# EasyEDA Pro project ProDoc_917_control_board_B.epro, schematic 917 control board_B, sheets 1 to 3 of 8

## Sheets
1 relay: Board Name: 917 control board_B; Create Date: 2025-07-29; Page Name: relay; Project Name: OHPP-002A-SiWG917 control board; Schematic Name: 917 control board_B; Update Date: 2025-08-06; Company: EasyEDA.com; Page Size: A3; Version: V1.0
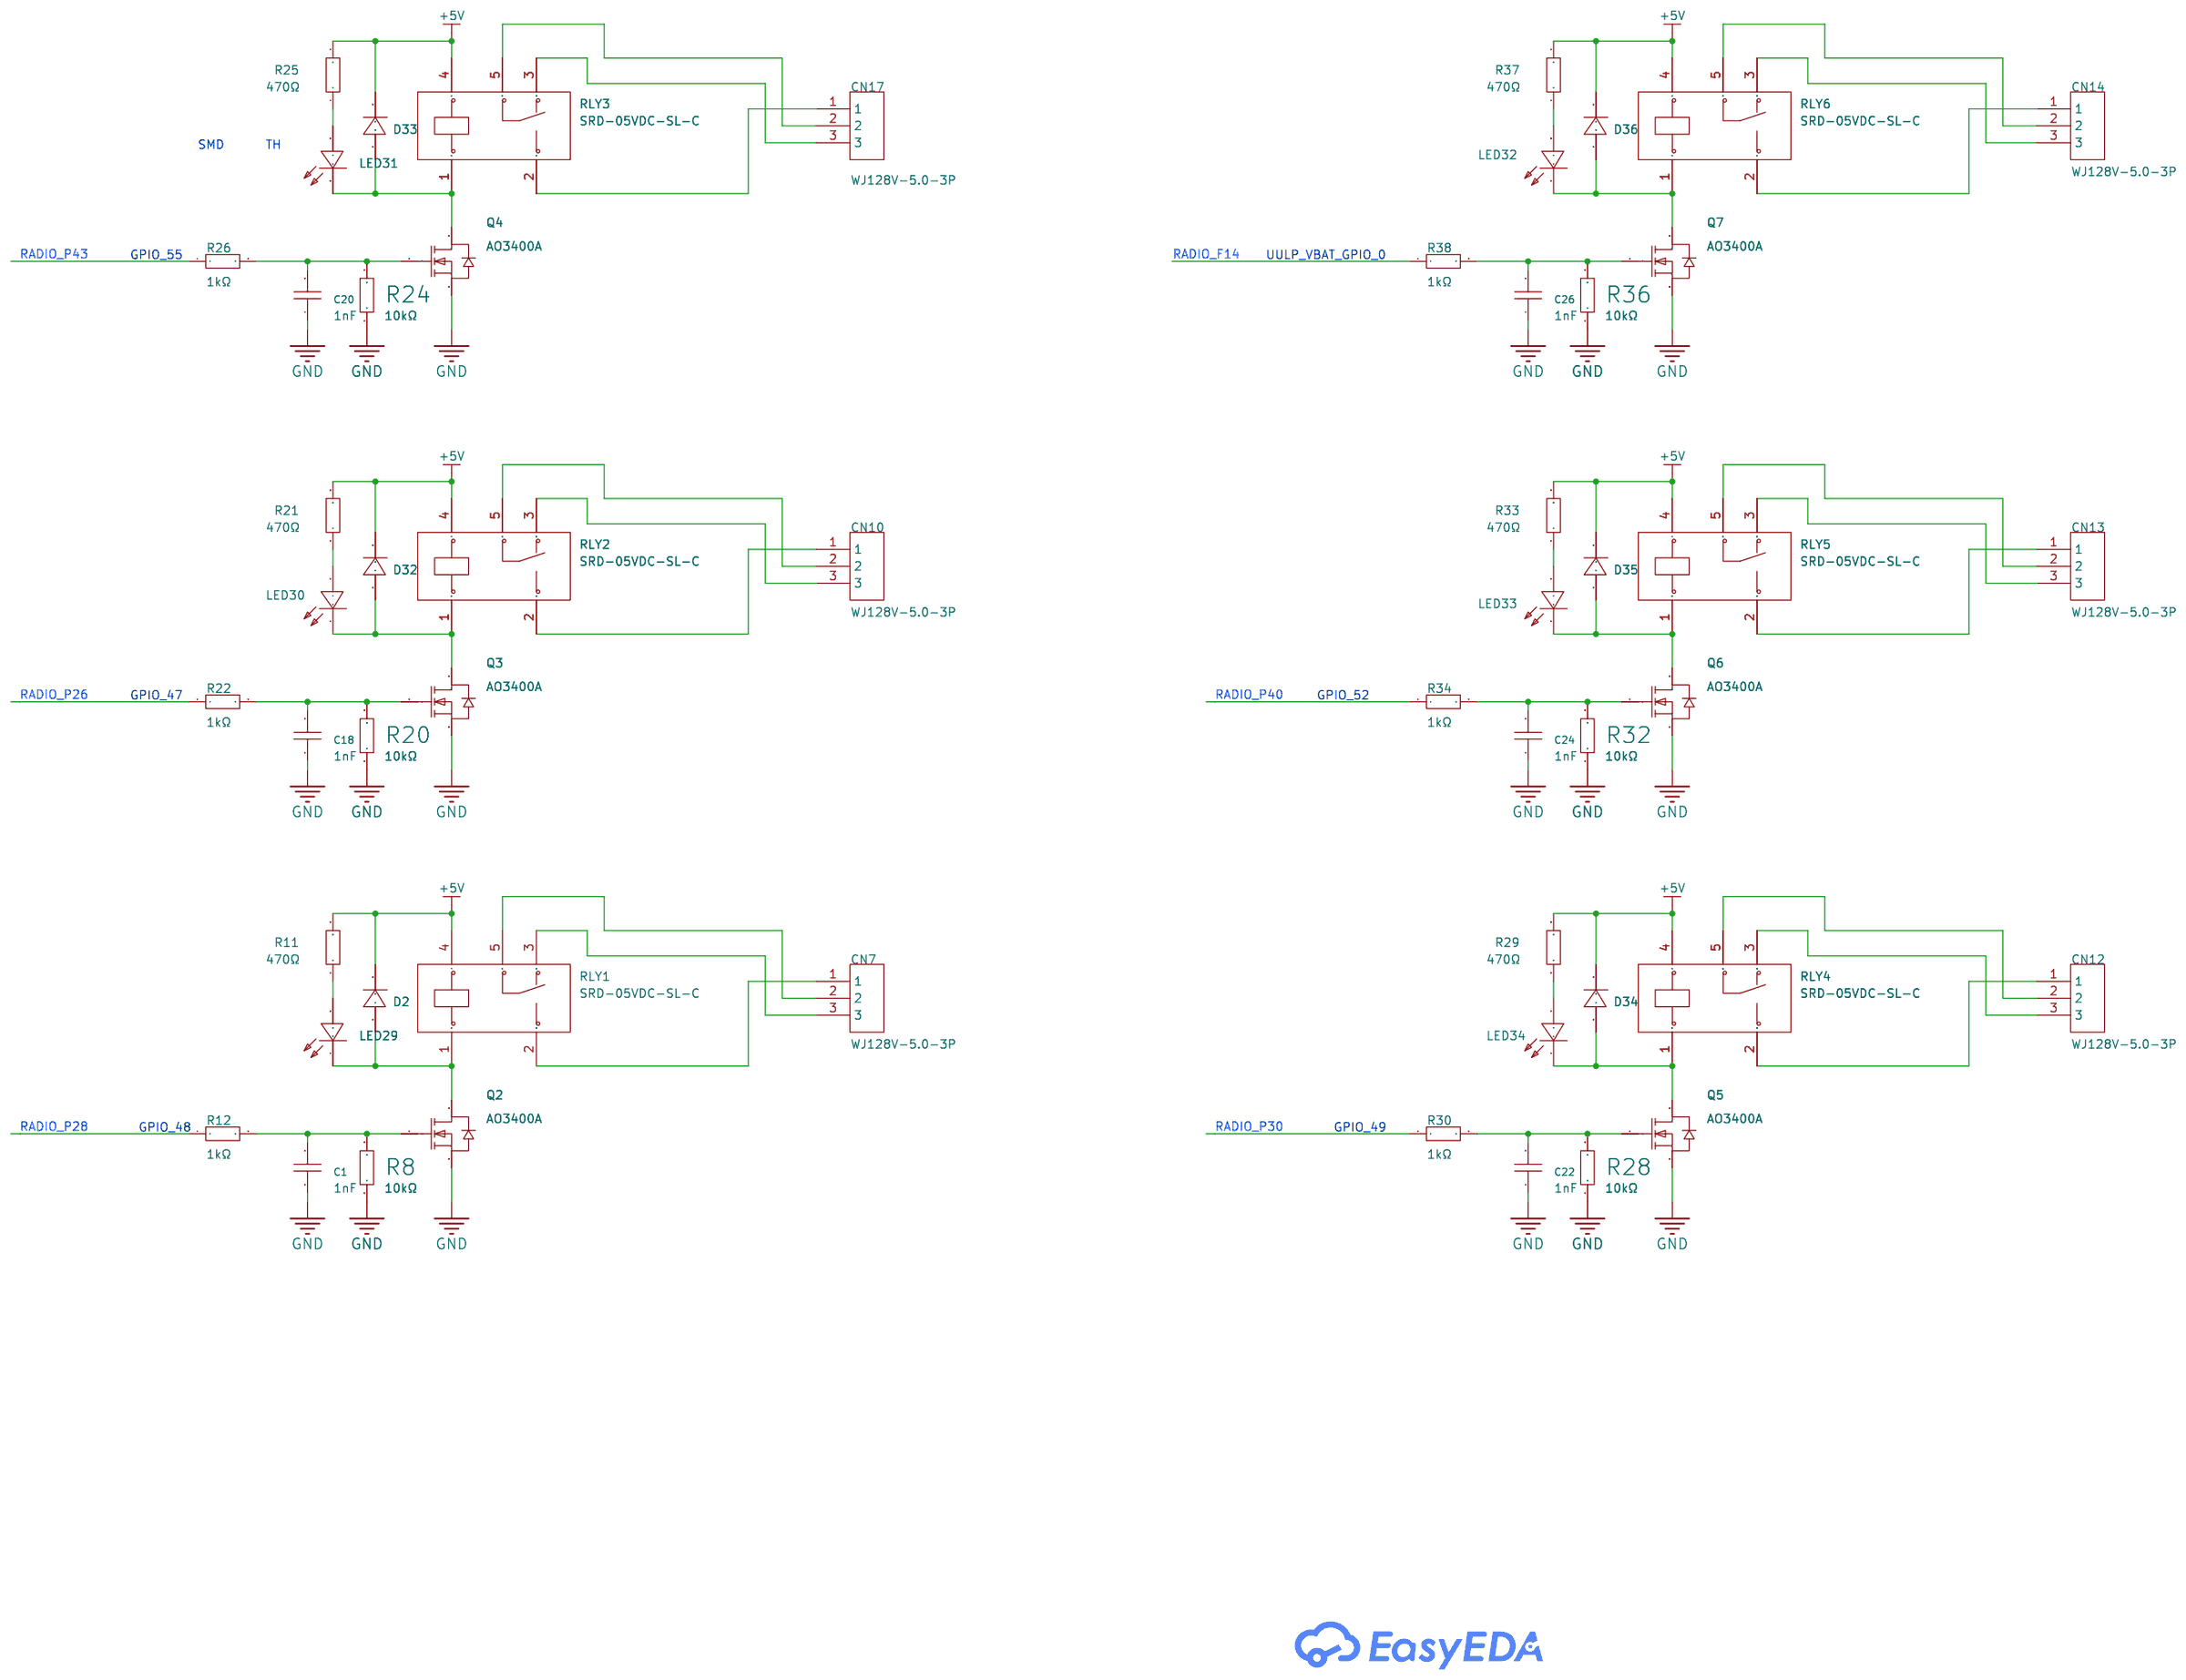
[diagram p0: relay]
2 917_radio_board: Page Name: 917_radio_board; Update Date: 2025-08-12
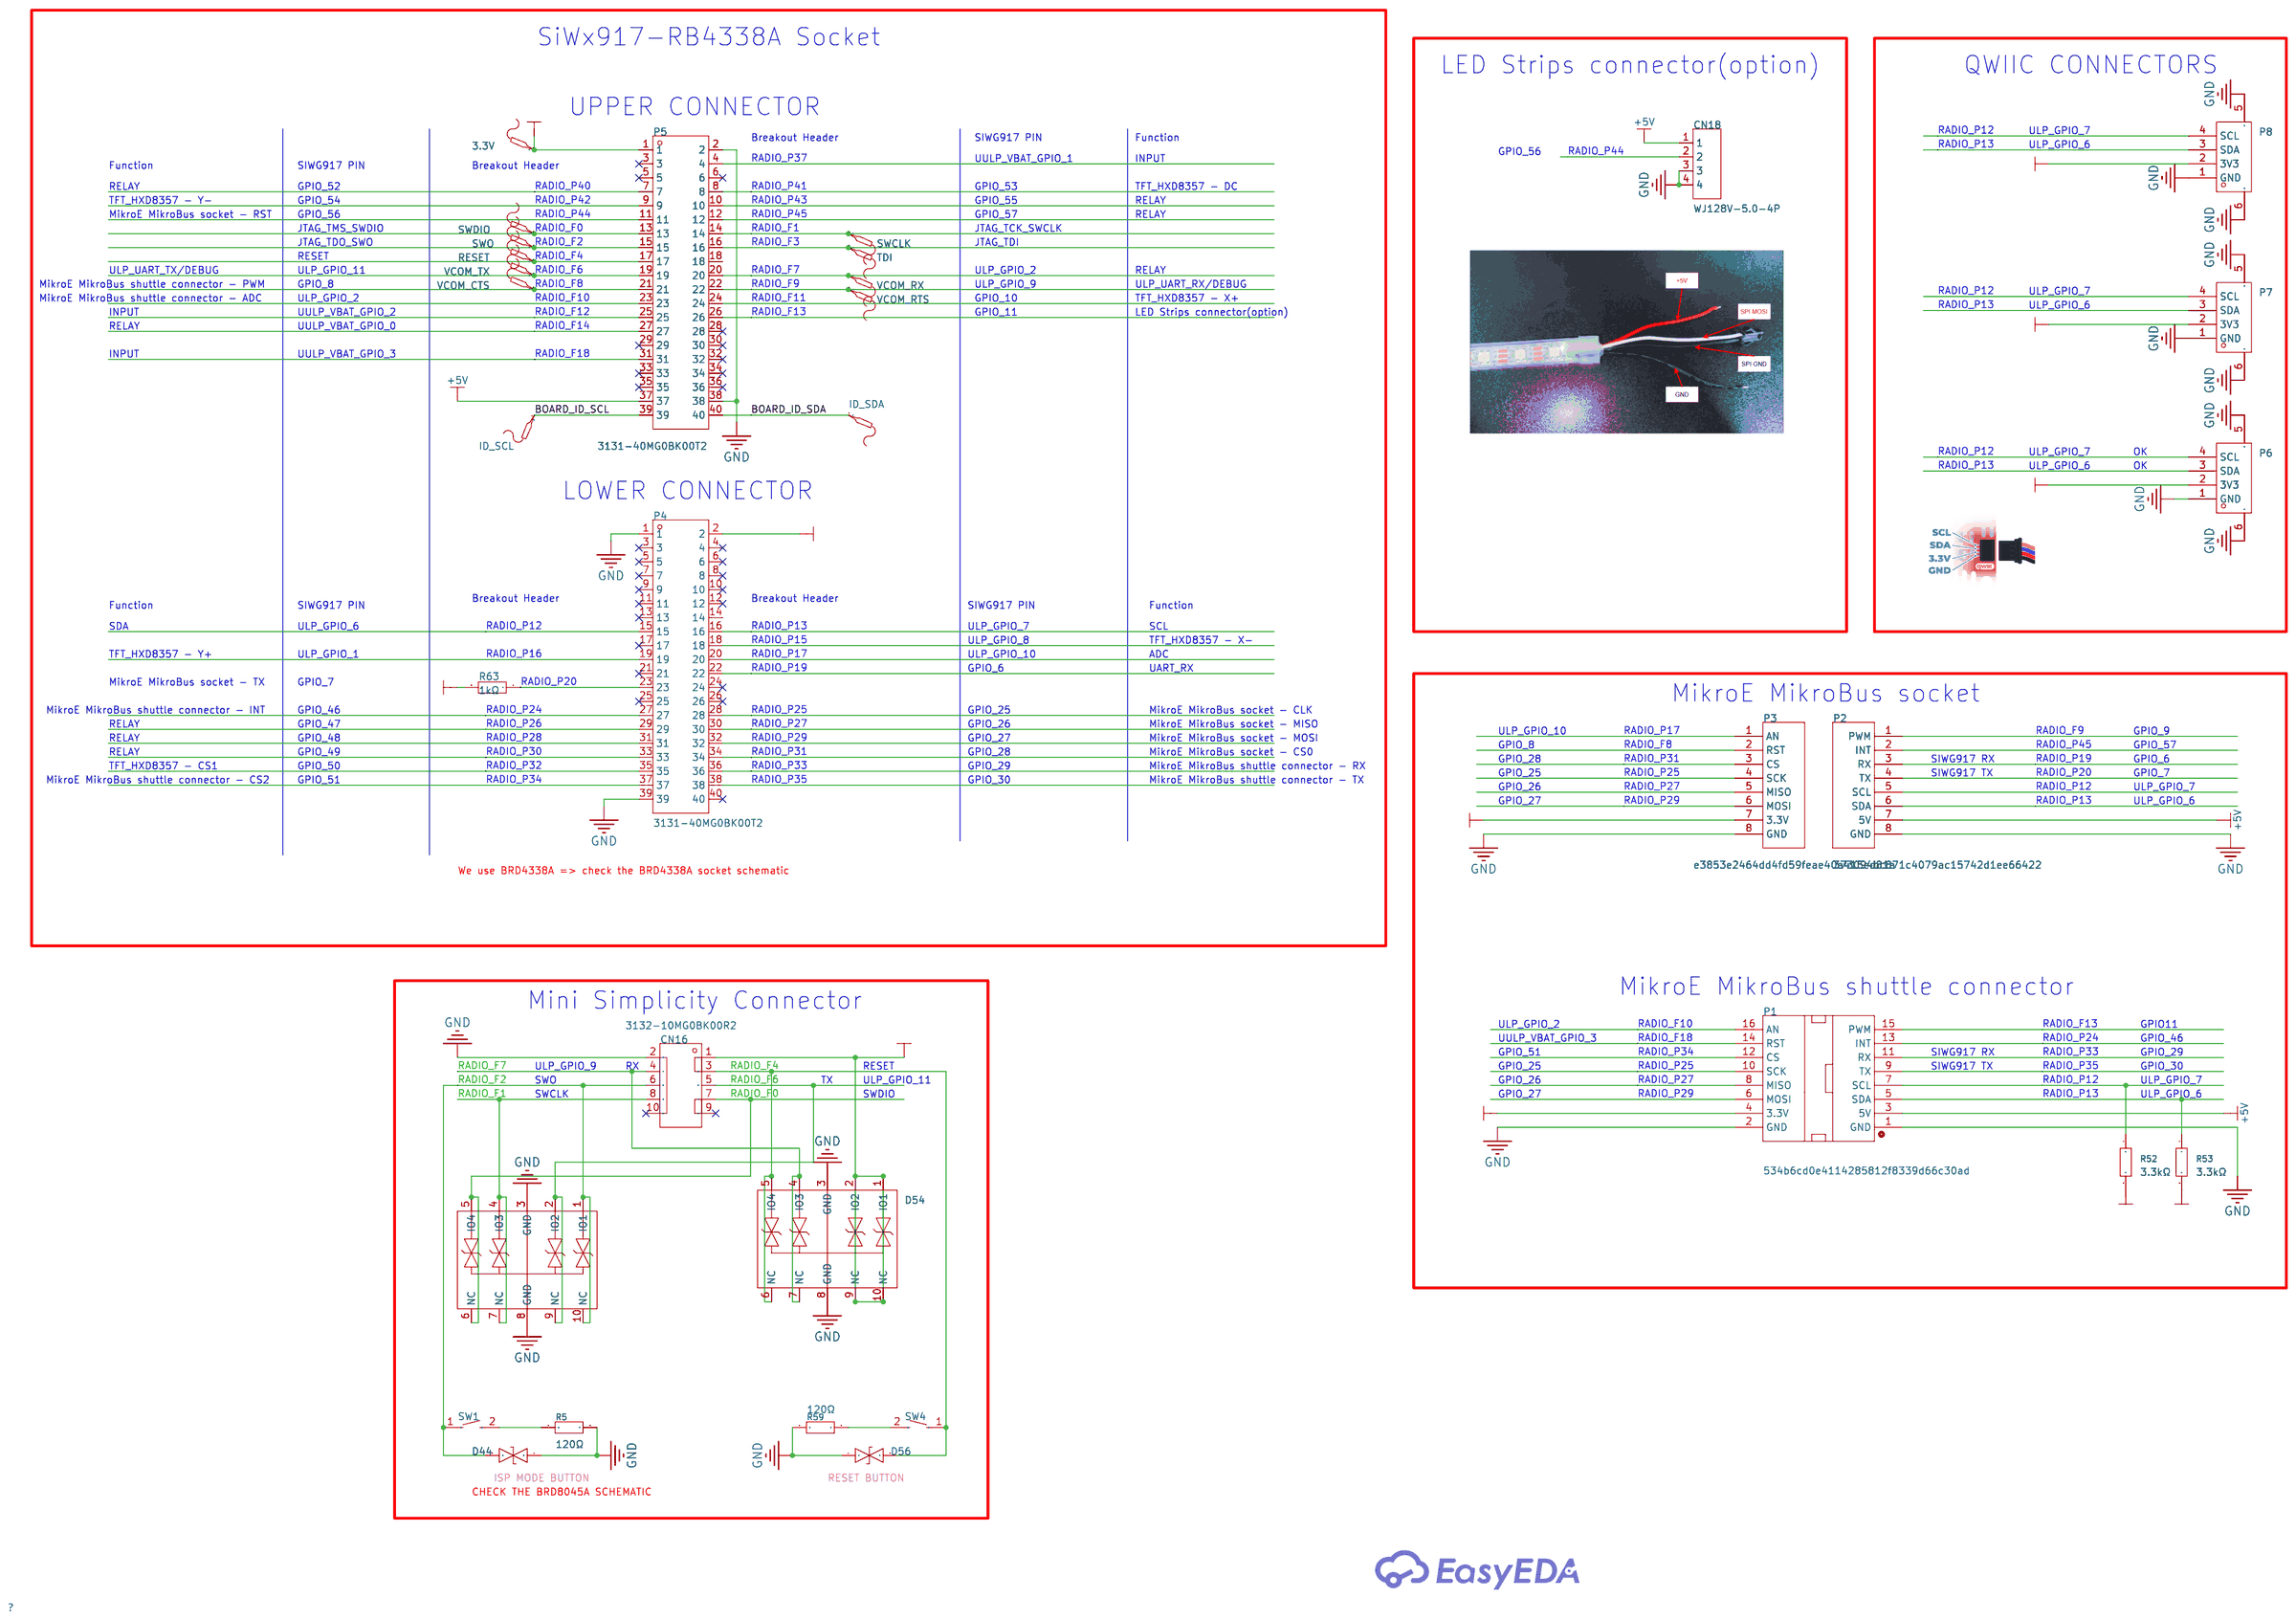
[diagram p1: 917_radio_board]
3 input: Page Name: P1; Project Name: Project Name; Schematic Name: Schematic Name; Update Date: 2021.11.05
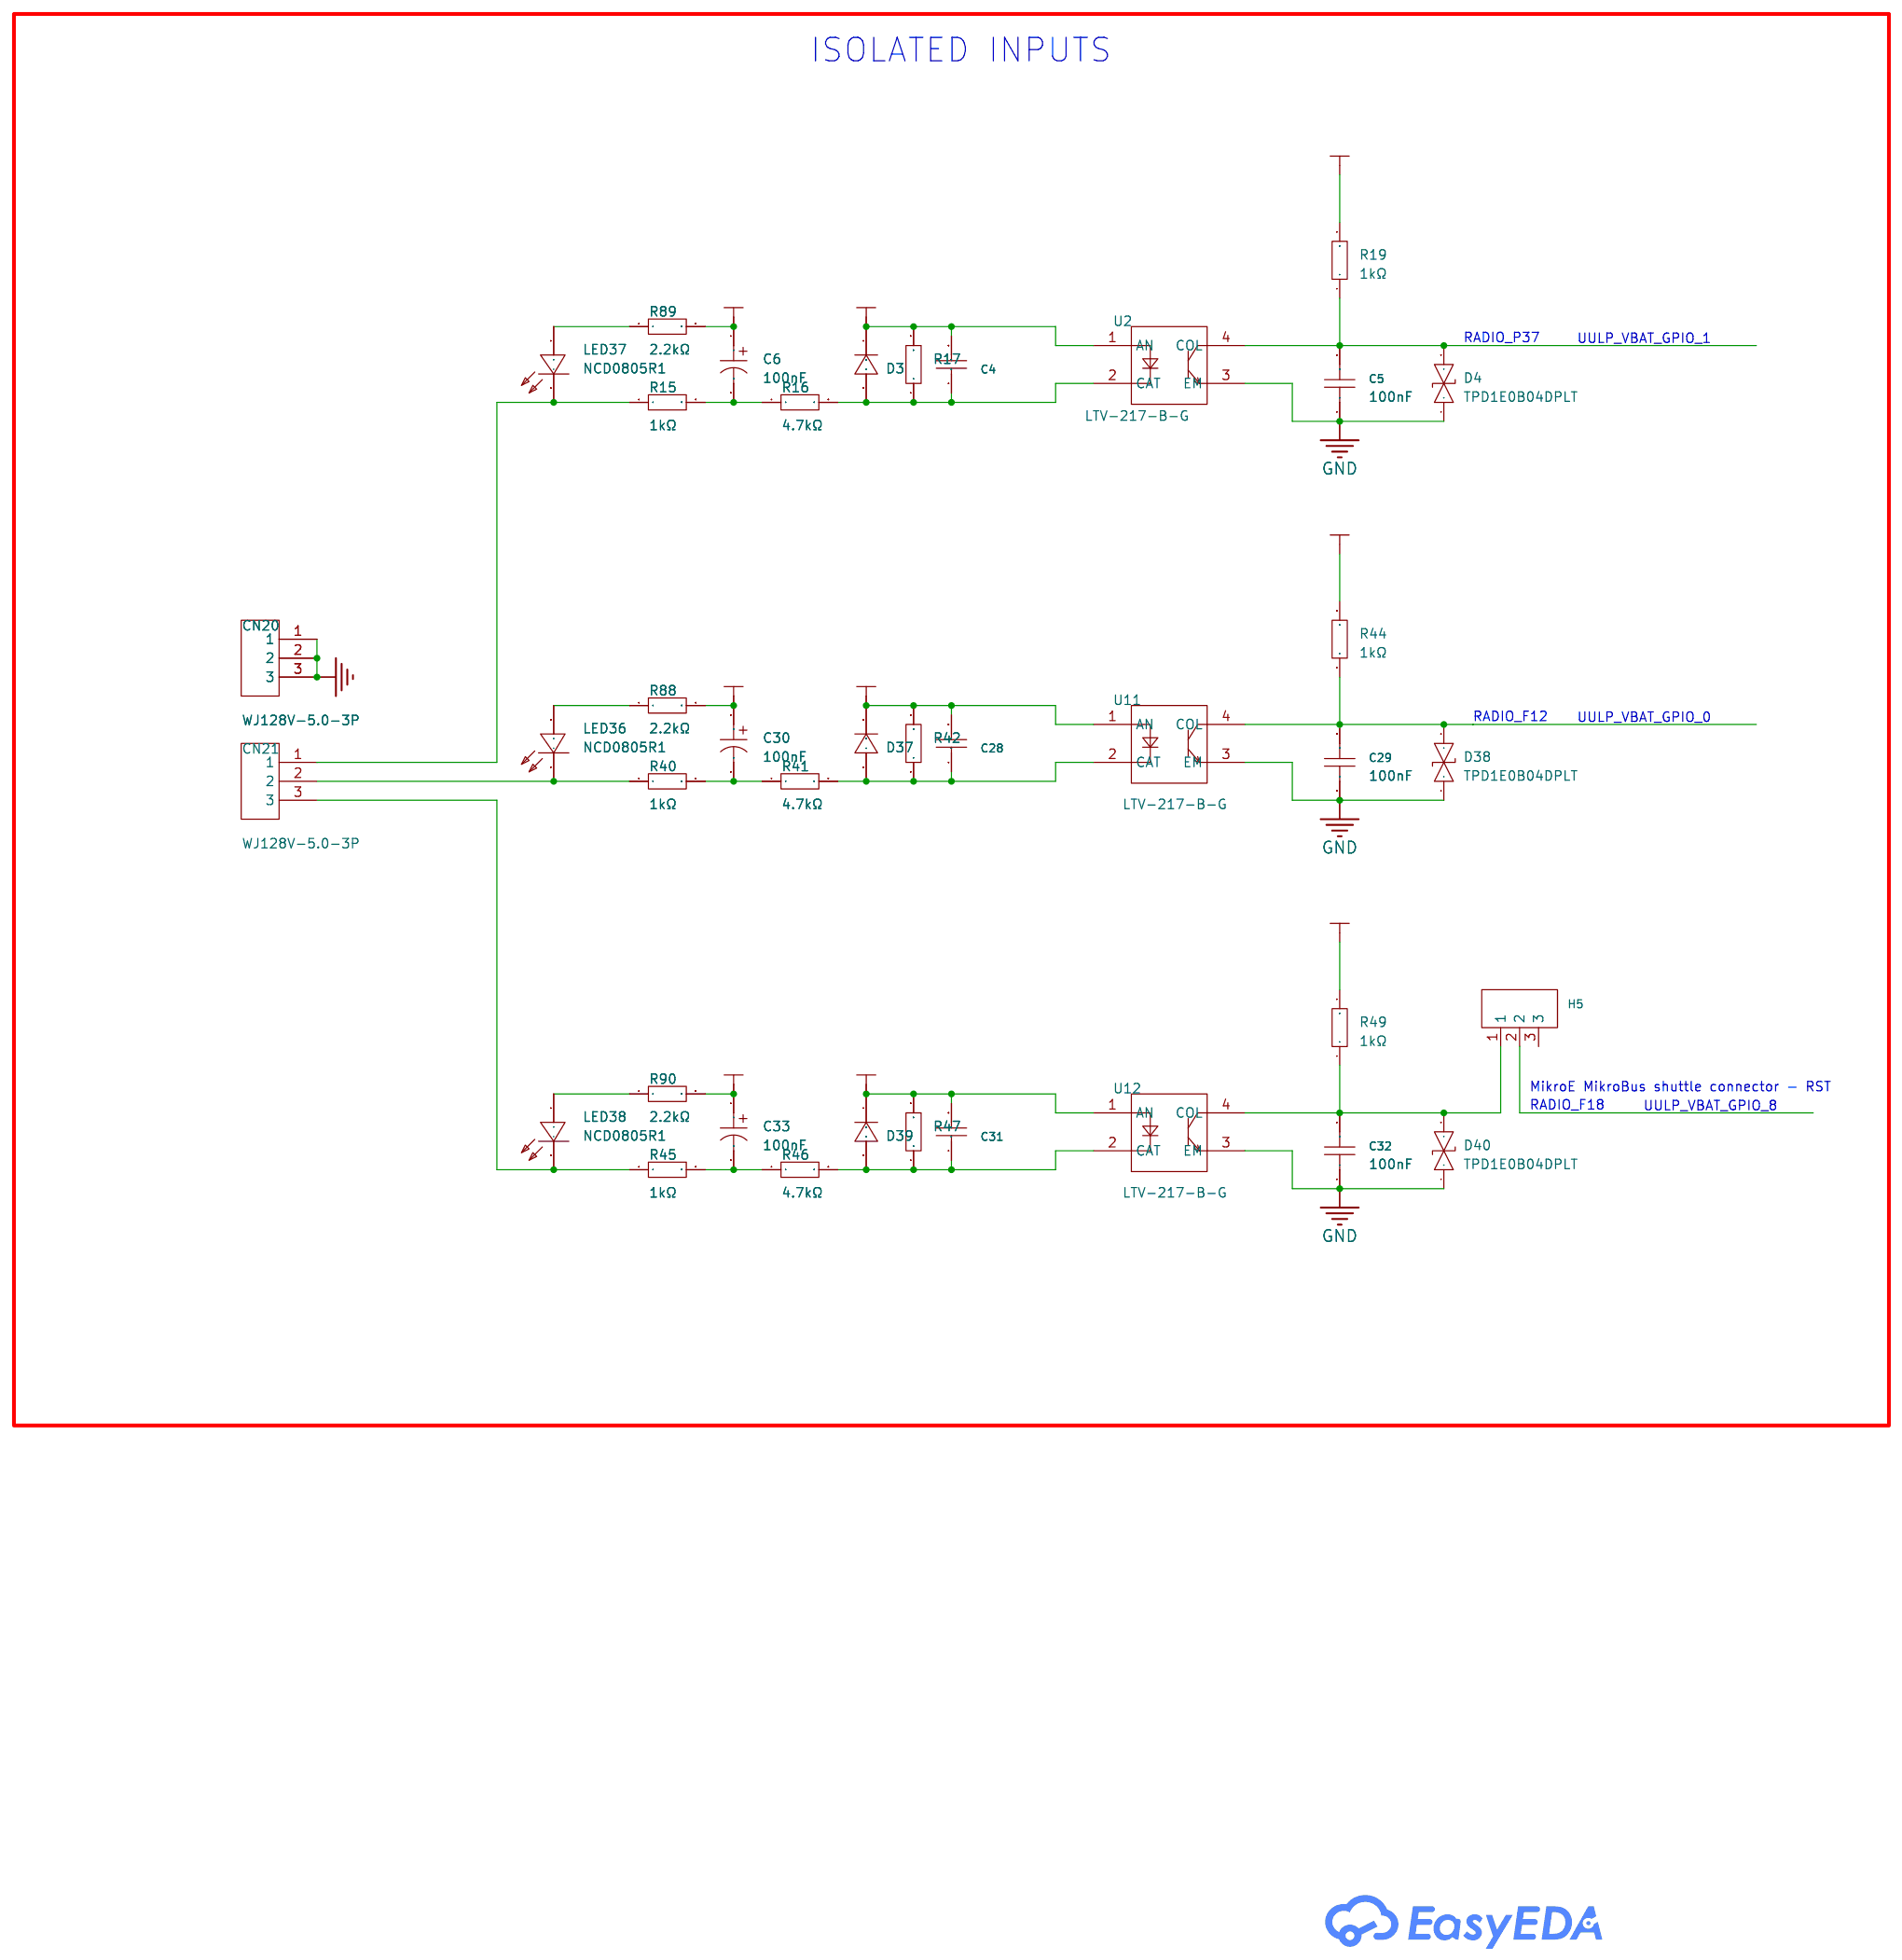
[diagram p2: input]

## Parts
sheet 917_radio_board
3.3V  -  [Test-Point-0.5mm]  (no BOM)
CN16  3132-10MG0BK00R2  [IDC-SMD_3132-10MG0BK00R2]
CN18  WJ128V-5.0-4P  [CONN-TH_4P-P5.00_WJ128V-4P-5.0-14-00A]
D44  TPD1E0B04DPLR  [TSSLP-2-3_L0.6-W0.3-P0.35-BI]  (no BOM)
D54  TPD4E02B04DQAR  [USON-10_L2.5-W1.0-P0.50-BL]
D56  TPD1E0B04DPLR  [TSSLP-2-3_L0.6-W0.3-P0.35-BI]  (no BOM)
D69  TPD4E02B04DQAR  [USON-10_L2.5-W1.0-P0.50-BL]
ID_SCL  -  [Test-Point-0.5mm]
ID_SDA  -  [Test-Point-0.5mm]  (no BOM)
P1  534b6cd0e4114285812f8339d66c30ad  [3221-16-0100-00_2]
P2  373094bc871c4079ac15742d1ee66422  [HDR-TH_8P-P2.54-V-F-1_3]
P3  e3853e2464dd4fd59feae40a415ed81a  [HDR-TH_8P-P2.54-V-F-1_2]
P4  3131-40MG0BK00T2  [CONN-SMD_40P-P1.27_WCON_3131-40MG0BK00T2_1]
P5  3131-40MG0BK00T2  [CONN-SMD_40P-P1.27_WCON_3131-40MG0BK00T2]
P6  HC-1.0-4PWT-B-HW  [CONN-SMD_4P-P1.00_HCTL_HC-1.0-4PWT]
P7  HC-1.0-4PWT-B-HW  [CONN-SMD_4P-P1.00_HCTL_HC-1.0-4PWT]
P8  HC-1.0-4PWT-B-HW  [CONN-SMD_4P-P1.00_HCTL_HC-1.0-4PWT]
R5  120Ω  [R0603]
R52  3.3kΩ  [R0603]
R53  3.3kΩ  [R0603]
R59  120Ω  [R0603]
R63  1kΩ  [R0603]  (no BOM)
RESET  -  [Test-Point-0.5mm]  (no BOM)
SW1  TS-1088-AR02016  [SW-SMD_L3.9-W3.0-P4.45]
SW4  TS-1088-AR02016  [SW-SMD_L3.9-W3.0-P4.45]
SWCLK  -  [Test-Point-0.5mm]  (no BOM)
SWDIO  -  [Test-Point-0.5mm]  (no BOM)
SWO  -  [Test-Point-0.5mm]  (no BOM)
TDI  -  [Test-Point-0.5mm]  (no BOM)
VCOM_CTS  -  [Test-Point-0.5mm]  (no BOM)
VCOM_RTS  -  [Test-Point-0.5mm]  (no BOM)
VCOM_RX  -  [Test-Point-0.5mm]  (no BOM)
VCOM_TX  -  [Test-Point-0.5mm]  (no BOM)
sheet input
C4  10nF  [C0603]
C5  100nF  [C0603]
C6  100nF  [CAP-SMD_L3.2-W1.6-FD]
C28  10nF  [C0603]
C29  100nF  [C0603]
C30  100nF  [CAP-SMD_L3.2-W1.6-FD]
C31  10nF  [C0603]
C32  100nF  [C0603]
C33  100nF  [CAP-SMD_L3.2-W1.6-FD]
CN20  WJ128V-5.0-3P  [CONN-TH_3P-P5.00_WJ128V-5.0-3P]
CN21  WJ128V-5.0-3P  [CONN-TH_3P-P5.00_WJ128V-5.0-3P]
D3  1N4148WS-7-F  [SOD-323_L1.8-W1.3-LS2.5-RD]
D4  TPD1E0B04DPLT  [X2SON-2_L0.6-W0.3-P0.35]  (no BOM)
D37  1N4148WS-7-F  [SOD-323_L1.8-W1.3-LS2.5-RD]
D38  TPD1E0B04DPLT  [X2SON-2_L0.6-W0.3-P0.35]  (no BOM)
D39  1N4148WS-7-F  [SOD-323_L1.8-W1.3-LS2.5-RD]
D40  TPD1E0B04DPLT  [X2SON-2_L0.6-W0.3-P0.35]  (no BOM)
H5  PZ2.54-1*3  [HDR-TH_3P-P2.54-V-M]
LED36  NCD0805R1  [LED0805-R-RD]
LED37  NCD0805R1  [LED0805-R-RD]
LED38  NCD0805R1  [LED0805-R-RD]
R15  1kΩ  [R0805]
R16  4.7kΩ  [R0805]
R17  100kΩ  [R0603]
R19  1kΩ  [R0603]
R40  1kΩ  [R0805]
R41  4.7kΩ  [R0805]
R42  100kΩ  [R0603]
R44  1kΩ  [R0603]
R45  1kΩ  [R0805]
R46  4.7kΩ  [R0805]
R47  100kΩ  [R0603]
R49  1kΩ  [R0603]
R88  2.2kΩ  [R0805]
R89  2.2kΩ  [R0805]
R90  2.2kΩ  [R0805]
U2  LTV-217-B-G  [SOP-4_L4.4-W2.8-P1.27-LS7.0-BR]
U11  LTV-217-B-G  [SOP-4_L4.4-W2.8-P1.27-LS7.0-BR]
U12  LTV-217-B-G  [SOP-4_L4.4-W2.8-P1.27-LS7.0-BR]
sheet relay
C1  1nF  [C0603]  (no BOM)
C18  1nF  [C0603]  (no BOM)
C20  1nF  [C0603]  (no BOM)
C22  1nF  [C0603]  (no BOM)
C24  1nF  [C0603]  (no BOM)
C26  1nF  [C0603]  (no BOM)
CN7  WJ128V-5.0-3P  [CONN-TH_3P-P5.00_WJ128V-5.0-3P]
CN10  WJ128V-5.0-3P  [CONN-TH_3P-P5.00_WJ128V-5.0-3P]
CN12  WJ128V-5.0-3P  [CONN-TH_3P-P5.00_WJ128V-5.0-3P]
CN13  WJ128V-5.0-3P  [CONN-TH_3P-P5.00_WJ128V-5.0-3P]
CN14  WJ128V-5.0-3P  [CONN-TH_3P-P5.00_WJ128V-5.0-3P]
CN17  WJ128V-5.0-3P  [CONN-TH_3P-P5.00_WJ128V-5.0-3P]
D2  NRVA4007T3G  [SMA_L4.3-W2.6-LS5.2-FD]
D32  NRVA4007T3G  [SMA_L4.3-W2.6-LS5.2-FD]
D33  NRVA4007T3G  [SMA_L4.3-W2.6-LS5.2-FD]
D34  NRVA4007T3G  [SMA_L4.3-W2.6-LS5.2-FD]
D35  NRVA4007T3G  [SMA_L4.3-W2.6-LS5.2-FD]
D36  NRVA4007T3G  [SMA_L4.3-W2.6-LS5.2-FD]
LED29  KT-0603R  [LED0603-RD]
LED30  KT-0603R  [LED0603-RD]
LED31  KT-0603R  [LED0603-RD]
LED32  KT-0603R  [LED0603-RD]
LED33  KT-0603R  [LED0603-RD]
LED34  KT-0603R  [LED0603-RD]
Q2  AO3400A  [SOT-23-3_L2.9-W1.3-P1.90-LS2.4-BR]
Q3  AO3400A  [SOT-23-3_L2.9-W1.3-P1.90-LS2.4-BR]
Q4  AO3400A  [SOT-23-3_L2.9-W1.3-P1.90-LS2.4-BR]
Q5  AO3400A  [SOT-23-3_L2.9-W1.3-P1.90-LS2.4-BR]
Q6  AO3400A  [SOT-23-3_L2.9-W1.3-P1.90-LS2.4-BR]
Q7  AO3400A  [SOT-23-3_L2.9-W1.3-P1.90-LS2.4-BR]
R8  10kΩ  [R0603]
R11  470Ω  [R0603]
R12  1kΩ  [R0603]
R20  10kΩ  [R0603]
R21  470Ω  [R0603]
R22  1kΩ  [R0603]
R24  10kΩ  [R0603]
R25  470Ω  [R0603]
R26  1kΩ  [R0603]
R28  10kΩ  [R0603]
R29  470Ω  [R0603]
R30  1kΩ  [R0603]
R32  10kΩ  [R0603]
R33  470Ω  [R0603]
R34  1kΩ  [R0603]
R36  10kΩ  [R0603]
R37  470Ω  [R0603]
R38  1kΩ  [R0603]
RLY1  SRD-05VDC-SL-C  [RELAY-TH_SRD-XXVDC-XL-C]
RLY2  SRD-05VDC-SL-C  [RELAY-TH_SRD-XXVDC-XL-C]
RLY3  SRD-05VDC-SL-C  [RELAY-TH_SRD-XXVDC-XL-C]
RLY4  SRD-05VDC-SL-C  [RELAY-TH_SRD-XXVDC-XL-C]
RLY5  SRD-05VDC-SL-C  [RELAY-TH_SRD-XXVDC-XL-C]
RLY6  SRD-05VDC-SL-C  [RELAY-TH_SRD-XXVDC-XL-C]

## Library data of the parts
3.3V ID_SCL ID_SDA RESET SWCLK SWDIO SWO TDI VCOM_CTS VCOM_RTS VCOM_RX VCOM_TX = Test-Point: Test Point 测试点
CN16 = 3132-10MG0BK00R2: Connector Type:简牛座 Pitch:1.27mm Structure:2x5P Holder Type:Brick nogging Row Spacing:1.27mm Number of Rows:2 Pin Number in each Row:5 Contact Material:Brass Contact Plating:Gold; Supplier: LCSC; Supplier Part: C783843; Manufacturer: Wcon(维峰电子); LCSC Part Name: 1.27mm 2x5P 排数:2 每排P数:5; Supplier Footprint: SMD,P=1.27mm; Datasheet: https://atta.szlcsc.com/upload/public/pdf/source/20200914/C783843_74B4F3B0F5055CA38342214C72674E3E.pdf; Connector Type: 简牛座; Pitch: 1.27mm; Structure: 2x5P; Holder Type: Brick nogging; Row Spacing: 1.27mm; Number of Rows: 2; Pin Number in each Row: 5; Contact Material: Brass; Contact Plating: Gold
CN18 = WJ128V-5.0-4P: Structure:1x4P Pitch:5mm Color:Green Mounting Style:Straight Current Rating (Max):20A Voltage Rating (Max):250V Number of Pins:4P Number of Rows:1 Wire Gauge - AWG:12~22 Wire Gauge - AWG:12~22 Wire Gauge - mm2:2.5 Wire Gauge - mm2:2.5 Number of PINs Per R; LCSC Part Name: 5mm 1x4P 排数:1 每排P数:4 直插; Supplier Part: C192769; Manufacturer: KANGNEX(康奈克斯电气); Supplier Footprint: 插件,P=5mm; JLCPCB Part Class: Extended Part; Datasheet: https://atta.szlcsc.com/upload/public/pdf/source/20191225/C192769_677B15EBBD9FD2D22E696A4E109D0907.pdf; Supplier: LCSC; Structure: 1x4P; Pitch: 5mm; Color: Green; Mounting Style: Straight; Current Rating (Max): 20A; Voltage Rating (Max): 250V; Number of Pins: 4P; Number of Rows: 1; Wire Gauge - AWG: 12~22; Wire Gauge - mm2: 2.5; Number of PINs Per Row: 4; Operating Temperature Range: -40℃~+105℃
D44 D56 = TPD1E0B04DPLR: polarity:- Reverse Stand-Off Voltage (Vrwm):3.6V Maximum Clamping Voltage:10.1V Peak Pulse Current (Ipp):1.7A@8/20us Peak Pulse Power Dissipation (Ppp):15W Breakdown Voltage:6.7V Reverse Leakage Current (Ir):- Number of Lines:- Operating Temperature:- Ope; Supplier Part: C913830; Manufacturer: TI(德州仪器); Supplier Footprint: X2-SON-2(0.3x0.6); JLCPCB Part Class: Extended Part; Datasheet: https://www.ti.com/cn/lit/gpn/tpd1e0b04; Supplier: LCSC; Reverse Stand-Off Voltage (Vrwm): 3.6V; Maximum Clamping Voltage: 10.1V; Peak Pulse Current (Ipp): 1.7A@8/20us; Peak Pulse Power Dissipation (Ppp): 15W; Breakdown Voltage: 6.7V; Type: TVS
D54 D69 = TPD4E02B04DQAR: polarity:Bi-Directional Reverse Stand-Off Voltage (Vrwm):3.6V Maximum Clamping Voltage:8.8V Peak Pulse Current (Ipp)@10/1000us:5A Peak Pulse Power Dissipation (Ppp)@10/1000us:17W Breakdown Voltage:5.5V Operating Temperature:-40℃~+125℃@(Ta) Operating Tempe; LCSC Part Name: 双向ESD; Supplier Part: C106794; Manufacturer: TI(德州仪器); Supplier Footprint: USON-10(1x2.5); JLCPCB Part Class: Extended Part; Datasheet: https://www.ti.com/cn/lit/gpn/tpd4e02b04; Supplier: LCSC; polarity: Bi-Directional; Reverse Stand-Off Voltage (Vrwm): 3.6V; Maximum Clamping Voltage: 8.8V; Peak Pulse Current (Ipp)@10/1000us: 5A; Peak Pulse Power Dissipation (Ppp)@10/1000us: 17W; Breakdown Voltage: 5.5V; Operating Temperature: -40℃~+125℃@(Ta); Type: ESD
P1 = 3221-16-0300-00_CP_V1.0.2: Holes Structure:2x8P Pitch:1.27mm Row Spacing:1.27mm Circular Hole / Square Hole:Square Holes Mounting Type:Brick nogging Number of Rows:双排 Number of Holes:16P Current Rating (Max):1A Voltage Rating (Max):- Holes Direction:Top Insulation Height:4.3mm Oper; LCSC Part Name: 1.27mm 2x8P; Supplier Part: C17378105; Manufacturer: CNC Tech; Manufacturer Part: 3221-16-0100-00; Supplier Footprint: SMD,P=1.27mm; Datasheet: https://lcsc.com/datasheet/lcsc_datasheet_2411272150_CNC-Tech-3221-16-0100-00_C17378105.pdf; Supplier: LCSC; Holes Structure: 2x8P; Pitch: 1.27mm; Row Spacing: 1.27mm; Circular Hole / Square Hole: Square Holes; Mounting Type: Brick nogging; Number of Holes: 16P; Current Rating (Max): 1A; Holes Direction: Top; Insulation Height: 4.3mm; Operating Temperature Range: -40℃~+105℃
P2 = MikroE-2.54-1*8P-R: Holes Structure:1x8P Pitch:2.54mm Row Spacing:- Mounting Type:Straight Number of Rows:Plugin Number of Holes:8P Insulation Height:- Contact Material:- Contact Plating:-; Supplier: LCSC; Manufacturer: BOOMELE(博穆精密); Manufacturer Part: 2.54-1*8P母环保; Supplier Part: C27438; LCSC Part Name: 间距:2.54mm 1x8P 直插; Supplier Footprint: 插件,P=2.54mm; Datasheet: https://atta.szlcsc.com/upload/public/pdf/source/20231221/1CA800C6799ED97958773716FAA1BFFE.pdf; Holes Structure: 1x8P; Pitch: 2.54mm; Mounting Type: Straight; Number of Rows: Plugin; Number of Holes: 8P
P3 = MikroE-2.54-1*8P-L: Holes Structure:1x8P Pitch:2.54mm Row Spacing:- Mounting Type:Straight Number of Rows:Plugin Number of Holes:8P Insulation Height:- Contact Material:- Contact Plating:-; Supplier: LCSC; Manufacturer: BOOMELE(博穆精密); Manufacturer Part: 2.54-1*8P母环保; Supplier Part: C27438; LCSC Part Name: 间距:2.54mm 1x8P 直插; Supplier Footprint: 插件,P=2.54mm; Datasheet: https://atta.szlcsc.com/upload/public/pdf/source/20231221/1CA800C6799ED97958773716FAA1BFFE.pdf; Holes Structure: 1x8P; Pitch: 2.54mm; Mounting Type: Straight; Number of Rows: Plugin; Number of Holes: 8P
P4 = 3131-40MG0BK00T2_CP_V1.0.1: Connector Type:Simple cow constellation Pitch:1.27mm Number of Positions or Pins:2x20P Current Rating:1A Voltage Rating (Max):- Holder Type:Standing paste Row Spacing:1.27mm Number of Rows:2 Number of PINs Per Row:20 Operating Temperature:-40℃~+105℃ Opera; Supplier Part: C976753; Manufacturer: Wcon(维峰电子); Supplier Footprint: SMD,P=1.27mm; Datasheet: https://atta.szlcsc.com/upload/public/pdf/source/20211202/B702BBAB0AED51B28E1877A6EDDD5ECD.pdf; Supplier: LCSC; Connector Type: Simple cow constellation; Pitch: 1.27mm; Number of Positions or Pins: 2x20P; Current Rating: 1A; Holder Type: Standing paste; Row Spacing: 1.27mm; Number of Rows: 2; Number of PINs Per Row: 20; Operating Temperature: -40℃~+105℃
P5 = 3131-40MG0BK00T2-UP-CP-V1.0.0: Connector Type:Simple cow constellation Pitch:1.27mm Number of Positions or Pins:2x20P Current Rating:1A Voltage Rating (Max):- Holder Type:Standing paste Row Spacing:1.27mm Number of Rows:2 Number of PINs Per Row:20 Operating Temperature:-40℃~+105℃ Opera; LCSC Part Name: 1.27mm 2x20P 排数:2 每排P数:20; Supplier Part: C976753; Manufacturer: Wcon(维峰电子); Supplier Footprint: SMD,P=1.27mm; Datasheet: https://atta.szlcsc.com/upload/public/pdf/source/20211202/B702BBAB0AED51B28E1877A6EDDD5ECD.pdf; Supplier: LCSC; Connector Type: Simple cow constellation; Pitch: 1.27mm; Number of Positions or Pins: 2x20P; Current Rating: 1A; Holder Type: Standing paste; Row Spacing: 1.27mm; Number of Rows: 2; Number of PINs Per Row: 20; Operating Temperature: -40℃~+105℃
P6-P8 = HC-1.0-4PWT-B-HW-cp-p1.0.0: Pins Structure:1x4P Pitch:1mm Mounting Style:Horizontal attachment Reference Series:SH Number of Pins:4P Number of Rows:1 Number of PINs Per Row:4 Row Spacing:- Current Rating (Max):1A Contact Material:Phosphor Bronze Contact Plating:Tin Operating Tempera; LCSC Part Name: 1x4P 间距:1mm 卧贴 系列:SH; Supplier Part: C19270571; Manufacturer: HCTL(华灿天禄); Supplier Footprint: SMD,P=1mm,卧贴; Datasheet: https://atta.szlcsc.com/upload/public/pdf/source/20231127/9E07C9D68B5C7BDBE054BC6E79D503BF.pdf; Supplier: LCSC; Pins Structure: 1x4P; Pitch: 1mm; Mounting Style: Horizontal attachment; Reference Series: SH; Number of Pins: 4P; Number of Rows: 1; Number of PINs Per Row: 4; Current Rating (Max): 1A; Contact Material: Phosphor Bronze; Contact Plating: Tin; Operating Temperature Range: -25℃~+85℃; Rated Voltage (Max): 50V; Plastic Material: LCP; Flame Retardant Rating: UL94V-0; Supplementary Features: Auxiliary soldering legs; Z-Height of the Board: 3.2mm; X-Length of Bottom Edge on Board (Spacing Line): 6.3mm; Y-Width of Bottom Edge on Board: 5.05mm
R5 R59 = 0603WAF1200T5E: Type:Thick Film Resistors Resistance: Tolerance:±1% Tolerance:±1% Power(Watts): Overload Voltage (Max): Temperature Coefficient:±100ppm/℃ Temperature Coefficient:±100ppm/℃ Operating Temperature Range:-55℃~+155℃ Operating Temperature Range:-55℃~+155℃; LCSC Part Name: 120Ω ±1% 100mW 厚膜电阻; Supplier Part: C22787; Manufacturer: UNI-ROYAL(厚声); Supplier Footprint: 0603; JLCPCB Part Class: Basic Part; Datasheet: https://atta.szlcsc.com/upload/public/pdf/source/20200306/C422600_1E6D84923E4A46A82E41ADD87F860B5C.pdf; Supplier: LCSC; Type: Thick Film Resistors; Tolerance: ±1%; Temperature Coefficient: ±100ppm/℃; Operating Temperature Range: -55℃~+155℃
R52 R53 = 0603WAF3301T5E: Type:Thick Film Resistors Resistance:3.3kΩ Tolerance:±1% Tolerance:±1% Power(Watts): Overload Voltage (Max): Temperature Coefficient:±100ppm/℃ Temperature Coefficient:±100ppm/℃ Operating Temperature Range:-55℃~+155℃ Operating Temperature Range:-55℃~+155℃; LCSC Part Name: 3.3kΩ ±1% 100mW 厚膜电阻; Supplier Part: C22978; Manufacturer: UNI-ROYAL(厚声); Supplier Footprint: 0603; JLCPCB Part Class: Basic Part; Datasheet: https://atta.szlcsc.com/upload/public/pdf/source/20200306/C422600_1E6D84923E4A46A82E41ADD87F860B5C.pdf; Supplier: LCSC; Type: Thick Film Resistors; Tolerance: ±1%; Temperature Coefficient: ±100ppm/℃; Operating Temperature Range: -55℃~+155℃
R12 R19 R22 R26 R30 R34 R38 R44 R49 R63 = 0603WAF1001T5E: Type:Thick Film Resistors Resistance:1kΩ Tolerance:±1% Tolerance:±1% Power(Watts): Overload Voltage (Max): Temperature Coefficient:±100ppm/℃ Temperature Coefficient:±100ppm/℃ Operating Temperature Range:-55℃~+155℃ Operating Temperature Range:-55℃~+155℃; LCSC Part Name: 1kΩ ±1% 100mW 厚膜电阻; Supplier Part: C21190; Manufacturer: UNI-ROYAL(厚声); Supplier Footprint: 0603; JLCPCB Part Class: Basic Part; Datasheet: https://atta.szlcsc.com/upload/public/pdf/source/20200306/C422600_1E6D84923E4A46A82E41ADD87F860B5C.pdf; Supplier: LCSC; Type: Thick Film Resistors; Tolerance: ±1%; Temperature Coefficient: ±100ppm/℃; Operating Temperature Range: -55℃~+155℃
SW1 SW4 = TS-1088-AR02016: Circuit:SPST Actuator Style:Round Button Operating Force:160gf Mounting Style:Brick nogging Switch Length:4mm Switch Width:3mm Switch Height:2mm Strike Gundam:不带 Contact Current:50mA Voltage Rating (DC):12V Insulation Resistance:100MΩ Actuator/Cap Color:B; LCSC Part Name: 4*3*2mm 立贴 轻触开关; Supplier Part: C720477; Manufacturer: XUNPU(讯普); Supplier Footprint: SMD; JLCPCB Part Class: Basic Part; Datasheet: https://atta.szlcsc.com/upload/public/pdf/source/20200810/C720475_60D09DD6C54279ADDB2DC25100F1CC11.pdf; Supplier: LCSC; Circuit: SPST; Actuator Style: Round Button; Operating Force: 160gf; Mounting Style: Brick nogging; Switch Length: 4mm; Switch Width: 3mm; Switch Height: 2mm; Strike Gundam: 不带; Contact Current: 50mA; Voltage Rating (DC): 12V; Insulation Resistance: 100MΩ; Actuator/Cap Color: Black; Pin Style: SMDSplicing; Mechanical Life: 10万次; Operating Temperature: -30℃~+80℃
C4 C28 C31 = 0603B103K500NT: Capacitance:10nF Tolerance:±10% Tolerance:±10% Voltage Rating:50V Temperature Coefficient:X7R; LCSC Part Name: 10nF ±10% 50V; Supplier Part: C57112; Manufacturer: FH(风华); Supplier Footprint: 0603; JLCPCB Part Class: Basic Part; Datasheet: https://atta.szlcsc.com/upload/public/pdf/source/20200305/C486355_26A10D38EF8C2A5C37091D0039909270.pdf; Supplier: LCSC; Tolerance: ±10%; Voltage Rating: 50V; Temperature Coefficient: X7R
C5 C29 C32 = CC0603KRX7R9BB104: Capacitance:100nF Tolerance:±10% Tolerance:±10% Voltage Rating:50V Temperature Coefficient:X7R; LCSC Part Name: 100nF ±10% 50V; Supplier Part: C14663; Manufacturer: YAGEO(国巨); Supplier Footprint: 0603; JLCPCB Part Class: Basic Part; Datasheet: https://atta.szlcsc.com/upload/public/pdf/source/20180910/C282072_33301C7F631E79921B82A8DAC6BCC5B3.pdf; Supplier: LCSC; Tolerance: ±10%; Temperature Coefficient: X7R; Voltage Rating: 50V
C6 C30 C33 = T491A104M050AT: Capacitance: Tolerance:±20% Tolerance:±20% Rated Voltage: Leakage Current(DCL):- Ripple Current:- Equivalent Series Resistance(ESR):20Ω Operating Temperature:-55℃~+125℃ Operating Temperature:-55℃~+125℃; LCSC Part Name: 100nF ±20% 50V; Supplier Part: C1952859; Manufacturer: KEMET(基美); Supplier Footprint: 1206; JLCPCB Part Class: Extended Part; Datasheet: https://atta.szlcsc.com/upload/public/pdf/source/20210416/95C0EC5B3581C9A90529545117ABEAC1.pdf; Supplier: LCSC; Tolerance: ±20%; Equivalent Series Resistance(ESR): 20Ω; Operating Temperature: -55℃~+125℃
CN7 CN10 CN12-CN14 CN17 CN20 CN21 = WJ128V-5.0-3P: Structure:1x3P Pitch:5mm Color:Green Mounting Style:Straight Current Rating (Max):20A Voltage Rating (Max):250V Number of Pins:3P Number of Rows:1 Wire Gauge - AWG:12~22 Wire Gauge - AWG:12~22 Wire Gauge - mm2:2.5 Wire Gauge - mm2:2.5 Number of PINs Per R; Supplier: LCSC; Manufacturer: KANGNEX(康奈克斯电气); Supplier Part: C8270; JLCPCB Part Class: Extended Part; LCSC Part Name: 5mm 1x3P 排数:1 每排P数:3 直插; Supplier Footprint: 插件,P=5mm; Datasheet: https://atta.szlcsc.com/upload/public/pdf/source/20191225/C8270_68EE597E4523D77F257225C74F324861.pdf; Structure: 1x3P; Pitch: 5mm; Color: Green; Mounting Style: Straight; Current Rating (Max): 20A; Voltage Rating (Max): 250V; Number of Pins: 3P; Number of Rows: 1; Wire Gauge - AWG: 12~22; Wire Gauge - mm2: 2.5; Number of PINs Per Row: 3; Operating Temperature Range: -40℃~+105℃
D3 D37 D39 = 1N4148WS-7-F: Diode Configuration:Independent Type Forward Voltage (Vf@If):1.25V@150mA Reverse Voltage (Vr): Rectified Current: Reverse Leakage Current:1uA@75V Reverse Recovery Time (trr): Operating Temperature:-65℃~+150℃@(Tj) Operating Temperature:-65℃~+150℃@(Tj); LCSC Part Name: 电压:75V 电流:150mA; Supplier Part: C60580; Manufacturer: DIODES(美台); Supplier Footprint: SOD-323; JLCPCB Part Class: Extended Part; Datasheet: https://atta.szlcsc.com/upload/public/pdf/source/20160107/1457707747110.pdf; Supplier: LCSC; Diode Configuration: Independent Type; Forward Voltage (Vf@If): 1.25V@150mA; Reverse Leakage Current: 1uA@75V; Operating Temperature: -65℃~+150℃@(Tj)
D4 D38 D40 = TPD1E0B04DPLT: Reverse Stand-Off Voltage (Vrwm):3.6V Maximum Clamping Voltage:10.1V Peak Pulse Current (Ipp):1.7A@8/20us Peak Pulse Power Dissipation (Ppp):15W Breakdown Voltage:6.7V Operating Temperature:-40℃~+125℃@(Ta) Operating Temperature:-40℃~+125℃@(Ta) Type:ESD; Supplier Part: C1973013; Manufacturer: TI(德州仪器); Supplier Footprint: X2-SON-2(0.3x0.6); JLCPCB Part Class: Extended Part; Datasheet: https://www.ti.com/cn/lit/gpn/tpd1e0b04; Supplier: LCSC; Reverse Stand-Off Voltage (Vrwm): 3.6V; Maximum Clamping Voltage: 10.1V; Peak Pulse Current (Ipp): 1.7A@8/20us; Peak Pulse Power Dissipation (Ppp): 15W; Breakdown Voltage: 6.7V; Operating Temperature: -40℃~+125℃@(Ta); Type: ESD
H5 = PZ2.54-1*3: Supplier Part: C5360899; Manufacturer: ZHOURI(洲日); Supplier Footprint: 插件,P=2.54mm; JLCPCB Part Class: Extended Part; Datasheet: https://atta.szlcsc.com/upload/public/pdf/source/20250227/F941FC765EF241ABFB2D5D72948A31A5.pdf; Supplier: LCSC
LED36-LED38 = NCD0805R1_C84256: Lamp Holder Type:- Emitted Color:Red Forward Voltage (VF):1.6V~2.6V Forward Voltage (VF):1.6V~2.6V Power Dissipation:65mW Forward Current:20mA Dominant Wavelength:615nm~630nm Dominant Wavelength:615nm~630nm Peak Wavelength:- Diode Configuration:独立二极管 Lens; Supplier Part: C84256; Manufacturer: 国星光电; Supplier Footprint: 0805; JLCPCB Part Class: Basic Part; Datasheet: https://atta.szlcsc.com/upload/public/pdf/source/20200820/C84256_F0A75A43B3EAD75808600A0514C76B99.pdf; Supplier: LCSC; Emitted Color: Red; Forward Voltage (VF): 1.6V~2.6V; Power Dissipation: 65mW; Forward Current: 20mA; Dominant Wavelength: 615nm~630nm; Diode Configuration: 独立二极管; Lens Color: 无色透明透镜; Luminous Intensity: 67mcd~195mcd; Viewing Angle: 130°; Operating Temperature: -30℃~+85℃
R15 R40 R45 = 0805W8F1001T5E: Type:Thick Film Resistors Resistance:1kΩ Tolerance:±1% Tolerance:±1% Power(Watts): Overload Voltage (Max): Temperature Coefficient:±100ppm/℃ Temperature Coefficient:±100ppm/℃ Operating Temperature Range:-55℃~+155℃ Operating Temperature Range:-55℃~+155℃; LCSC Part Name: 1kΩ ±1% 125mW 厚膜电阻; Supplier Part: C17513; Manufacturer: UNI-ROYAL(厚声); Supplier Footprint: 0805; JLCPCB Part Class: Basic Part; Datasheet: https://atta.szlcsc.com/upload/public/pdf/source/20200306/C422600_1E6D84923E4A46A82E41ADD87F860B5C.pdf; Supplier: LCSC; Type: Thick Film Resistors; Tolerance: ±1%; Temperature Coefficient: ±100ppm/℃; Operating Temperature Range: -55℃~+155℃
R16 R41 R46 = 0805W8F4701T5E: Type:Thick Film Resistors Resistance:4.7kΩ Tolerance:±1% Tolerance:±1% Power(Watts): Overload Voltage (Max): Temperature Coefficient:±100ppm/℃ Temperature Coefficient:±100ppm/℃ Operating Temperature Range:-55℃~+155℃ Operating Temperature Range:-55℃~+155℃; LCSC Part Name: 4.7kΩ ±1% 125mW 厚膜电阻; Supplier Part: C17673; Manufacturer: UNI-ROYAL(厚声); Supplier Footprint: 0805; JLCPCB Part Class: Basic Part; Datasheet: https://atta.szlcsc.com/upload/public/pdf/source/20200306/C422600_1E6D84923E4A46A82E41ADD87F860B5C.pdf; Supplier: LCSC; Type: Thick Film Resistors; Tolerance: ±1%; Temperature Coefficient: ±100ppm/℃; Operating Temperature Range: -55℃~+155℃
R17 R42 R47 = 0603WAF1003T5E: Type:Thick Film Resistors Resistance:100kΩ Tolerance:±1% Tolerance:±1% Power(Watts): Overload Voltage (Max): Temperature Coefficient:±100ppm/℃ Temperature Coefficient:±100ppm/℃ Operating Temperature Range:-55℃~+155℃ Operating Temperature Range:-55℃~+155℃; LCSC Part Name: 100kΩ ±1% 100mW 厚膜电阻; Supplier Part: C25803; Manufacturer: UNI-ROYAL(厚声); Supplier Footprint: 0603; JLCPCB Part Class: Basic Part; Datasheet: https://atta.szlcsc.com/upload/public/pdf/source/20200306/C422600_1E6D84923E4A46A82E41ADD87F860B5C.pdf; Supplier: LCSC; Type: Thick Film Resistors; Tolerance: ±1%; Temperature Coefficient: ±100ppm/℃; Operating Temperature Range: -55℃~+155℃
R88-R90 = 0805W8F2201T5E_C17520: Type:Thick Film Resistors Resistance:2.2kΩ Tolerance:±1% Tolerance:±1% Power(Watts): Overload Voltage (Max): Temperature Coefficient:±100ppm/℃ Temperature Coefficient:±100ppm/℃ Operating Temperature Range:-55℃~+155℃ Operating Temperature Range:-55℃~+155℃; LCSC Part Name: 2.2kΩ ±1% 125mW 厚膜电阻; Supplier Part: C17520; Manufacturer: UNI-ROYAL(厚声); Manufacturer Part: 0805W8F2201T5E; Supplier Footprint: 0805; JLCPCB Part Class: Basic Part; Datasheet: https://atta.szlcsc.com/upload/public/pdf/source/20200306/C422600_1E6D84923E4A46A82E41ADD87F860B5C.pdf; Supplier: LCSC; Type: Thick Film Resistors; Tolerance: ±1%; Temperature Coefficient: ±100ppm/℃; Operating Temperature Range: -55℃~+155℃
U2 U11 U12 = LTV-217-B-G: Input voltage type:- Output Type:Phototransistor Voltage - Forward(Vf):1.2V Output Current:50mA Isolation Voltage(Vrms):3kV Reverse Voltage:6V Load Voltage:70V Number of Outputs:1 Vce Saturation(VCE(sat)):400mV@8mA,2.4mA Rise time:2us Fall time:3us Operat; LCSC Part Name: DC输入 隔离电压(rms):3000V; Supplier Part: C115450; Manufacturer: LITEON(光宝); Supplier Footprint: SOP-4-175mil; JLCPCB Part Class: Basic Part; Datasheet: https://atta.szlcsc.com/upload/public/pdf/source/20241220/370987480C4ADFF6A92F1196CD083AA9.pdf; Supplier: LCSC; Output Type: Phototransistor; Voltage - Forward(Vf): 1.2V; Output Current: 50mA; Isolation Voltage(Vrms): 3kV; Reverse Voltage: 6V; Load Voltage: 70V; Number of Outputs: 1; Vce Saturation(VCE(sat)): 400mV@8mA,2.4mA; Rise time: 2us; Fall time: 3us; Operating Temperature: -55℃~+110℃; Current Transfer Ratio (CTR) Minimum: 50%; Current Transfer Ratio (CTR) Maximum/Saturation Value: 600%
C1 C18 C20 C22 C24 C26 = CL10B102KB8NNNC: Capacitance: Tolerance:±10% Tolerance:±10% Voltage Rated: Temperature Coefficient:; LCSC Part Name: 1nF ±10% 50V; Supplier Part: C1588; Manufacturer: SAMSUNG(三星); Supplier Footprint: 0603; JLCPCB Part Class: Basic Part; Datasheet: https://atta.szlcsc.com/upload/public/pdf/source/20160218/1457707763339.pdf; Supplier: LCSC; Tolerance: ±10%
D2 D32-D36 = NRVA4007T3G: Diode Configuration: Forward Voltage (Vf@If):1.18V@2A Reverse Voltage (Vr): Rectified Current: Reverse Leakage Current:10uA@1kV; LCSC Part Name: 电压:1kV 电流:1A; Supplier Part: C236166; Manufacturer: onsemi(安森美); Supplier Footprint: SMA(DO-214AC); JLCPCB Part Class: Extended Part; Datasheet: https://atta.szlcsc.com/upload/public/pdf/source/20181113/C236166_AA08B53D0A5A7B378A4AB9924EDE3BEF.pdf; Supplier: LCSC; Forward Voltage (Vf@If): 1.18V@2A; Reverse Leakage Current: 10uA@1kV
LED29-LED34 = KT-0603R: Emitted Color:Red Power Dissipation:- Forward Current:- Dominant Wavelength:- Dominant Wavelength:- Peak Wavelength:- Diode Configuration:- Lens Color:- Color Temperature:- Color Temperature:- Viewing Angle:- Mounting Sytle:- Operating Temperature:-40℃~+8; LCSC Part Name: 0603 红灯 高亮; Supplier Part: C2286; Manufacturer: KENTO; Supplier Footprint: 0603; JLCPCB Part Class: Basic Part; Datasheet: https://atta.szlcsc.com/upload/public/pdf/source/20160616/1466072038404.pdf; Supplier: LCSC; Emitted Color: Red; Operating Temperature: -40℃~+85℃
Q2-Q7 = AO3400A_C20917: Type:1 N-Channel Drain Source Voltage (Vdss): Continuous Drain Current (Id): Drain Source On Resistance (RDS(on)@Vgs,Id):26.5mΩ@10V,5.7A Power Dissipation (Pd): Gate Threshold Voltage (Vgs(th)@Id):1.5V@250uA Total Gate Charge (Qg@Vgs):7nC@4.5V Input Capac; LCSC Part Name: 1个N沟道 耐压:30V 电流:5.7A; Supplier Part: C20917; Manufacturer: AOS; Supplier Footprint: SOT-23-3L; JLCPCB Part Class: Basic Part; Datasheet: https://atta.szlcsc.com/upload/public/pdf/source/20140107/1457706668533.pdf; Supplier: LCSC; Type: 1 N-Channel; Drain Source On Resistance (RDS(on)@Vgs,Id): 26.5mΩ@10V,5.7A; Gate Threshold Voltage (Vgs(th)@Id): 1.5V@250uA; Total Gate Charge (Qg@Vgs): 7nC@4.5V; Input Capacitance (Ciss@Vds): 630pF@15V; Operating Temperature: -55℃~+150℃@(Tj)
R8 R20 R24 R28 R32 R36 = 0603WAF1002T5E: Type:Thick Film Resistors Resistance:10kΩ Tolerance:±1% Tolerance:±1% Power(Watts): Overload Voltage (Max): Temperature Coefficient:±100ppm/℃ Temperature Coefficient:±100ppm/℃ Operating Temperature Range:-55℃~+155℃ Operating Temperature Range:-55℃~+155℃; LCSC Part Name: 厚膜电阻 10kΩ ±1% 100mW; Supplier Part: C25804; Manufacturer: UNI-ROYAL(厚声); Supplier Footprint: 0603; JLCPCB Part Class: Basic Part; Datasheet: https://atta.szlcsc.com/upload/public/pdf/source/20200306/C422600_1E6D84923E4A46A82E41ADD87F860B5C.pdf; Supplier: LCSC; Type: Thick Film Resistors; Tolerance: ±1%; Temperature Coefficient: ±100ppm/℃; Operating Temperature Range: -55℃~+155℃
R11 R21 R25 R29 R33 R37 = 0603WAF4700T5E: Type:Thick Film Resistors Resistance: Tolerance:±1% Tolerance:±1% Power(Watts): Overload Voltage (Max): Temperature Coefficient:±100ppm/℃ Temperature Coefficient:±100ppm/℃ Operating Temperature Range:-55℃~+155℃ Operating Temperature Range:-55℃~+155℃; LCSC Part Name: 470Ω ±1% 100mW 厚膜电阻; Supplier Part: C23179; Manufacturer: UNI-ROYAL(厚声); Supplier Footprint: 0603; JLCPCB Part Class: Basic Part; Datasheet: https://atta.szlcsc.com/upload/public/pdf/source/20200306/C422600_1E6D84923E4A46A82E41ADD87F860B5C.pdf; Supplier: LCSC; Type: Thick Film Resistors; Tolerance: ±1%; Temperature Coefficient: ±100ppm/℃; Operating Temperature Range: -55℃~+155℃
RLY1-RLY6 = SRD-05VDC-SL-C: Coil Voltage:5V Contact Form:一组转换:1C(SPDT-转换) Pin Number:5 Contact Rating:- Maximum Switching Voltage:250V@AC Coil Rated Power:360mW Maximum Switching Current:15A Coil Type:无极性-单线圈 Coil Resistance:70Ω Contact Resistance:100mΩ Operate Time:10ms Release Tim; LCSC Part Name: 蓝色; Supplier Part: C35449; Manufacturer: 松乐; Supplier Footprint: 插件,15.6x19.2mm; JLCPCB Part Class: Extended Part; Datasheet: https://atta.szlcsc.com/upload/public/pdf/source/20200305/C490149_C96E4098A3B1FFB377D5AD2E40B7C2A8.pdf; Supplier: LCSC; Coil Voltage: 5V; Contact Form: 一组转换:1C(SPDT-转换); Pin Number: 5; Maximum Switching Voltage: 250V@AC; Coil Rated Power: 360mW; Maximum Switching Current: 15A; Coil Type: 无极性-单线圈; Coil Resistance: 70Ω; Contact Resistance: 100mΩ; Operate Time: 10ms; Release Time: 10ms

## Nets
+3V3: 3.3V.1 CN16.1 D54.1(IO1) D54.2(IO2) D54.9(NC) D54.10(NC) P1.4(3.3V) P3.7(3.3V) P4.2 P5.1 P6.2(3V3) P7.2(3V3) P8.2(3V3) R19.2 R44.2 R49.2 R52.2 R53.2 R63.2 ; also on sheet 4 7
+5V: CN18.1 D2.2 D32.2 D33.2 D34.2 D35.2 D36.2 P1.3(5V) P2.7(5V) P5.37 R11.2 R21.2 R25.2 R29.2 R33.2 R37.2 RLY1.4 RLY2.4 RLY3.4 RLY4.4 RLY5.4 RLY6.4 ; also on sheet 4 6 7
+12V_IN: C4.2 C6.1 C28.2 C30.1 C31.2 C33.1 D3.1(C) D37.1(C) D39.1(C) R17.2 R42.2 R47.2 R88.2 R89.2 R90.2 U2.1(AN) U11.1(AN) U12.1(AN) ; also on sheet 4
GND: C1.1 C5.1 C18.1 C20.1 C22.1 C24.1 C26.1 C29.1 C32.1 CN16.2 CN18.3 CN18.4 D4.1(K) D38.1(K) D40.1(K) D44.1(IO) D54.3(GND) D54.8(GND) D56.1(IO) D69.3(GND) D69.8(GND) P1.1(GND) P1.2(GND) P2.8(GND) P3.8(GND) P4.1 P4.39 P5.2 P5.38 P6.1(GND) P6.5(MH) P6.6(MH) P7.1(GND) P7.5(MH) P7.6(MH) P8.1(GND) P8.5(MH) P8.6(MH) Q2.2(S) Q3.2(S) Q4.2(S) Q5.2(S) Q6.2(S) Q7.2(S) R5.2 R8.1 R20.1 R24.1 R28.1 R32.1 R36.1 R59.2 U2.3(EM) U11.3(EM) U12.3(EM) ; also on sheet 4 6 7
GND1: CN20.1 CN20.2 CN20.3 ; also on sheet 4
BOARD_ID_SCL: ID_SCL.1 P5.39 ; also on sheet 7
BOARD_ID_SDA: ID_SDA.1 P5.40 ; also on sheet 7
RADIO_F0: CN16.7 D69.5(IO4) D69.6(NC) P5.13 SWDIO.1
RADIO_F1: CN16.8 D69.4(IO3) D69.7(NC) P5.14 SWCLK.1
RADIO_F2: CN16.6 D44.2(IO) D69.1(IO1) D69.10(NC) P5.15 SW1.1 SWO.1
RADIO_F3: P5.16 TDI.1
RADIO_F4: CN16.3 D54.5(IO4) D54.6(NC) D56.2(IO) P5.17 RESET.1 SW4.1
RADIO_F6: CN16.5 D69.2(IO2) D69.9(NC) P5.19 VCOM_TX.1 ; also on sheet 7
RADIO_F7: CN16.4 D54.4(IO3) D54.7(NC) P5.20 VCOM_RX.1 ; also on sheet 7
RADIO_F8: P3.2(RST) P5.21 VCOM_CTS.1
RADIO_F9: P2.1(PWM) P5.22 VCOM_RTS.1
RADIO_F10: P1.16(AN) P5.23
RADIO_F11: P5.24 ; also on sheet 6
RADIO_F12: C29.2 D38.2(A) P5.25 R44.1 U11.4(COL)
RADIO_F13: P1.15(PWM) P5.26
RADIO_F14: P5.27 R38.1
RADIO_F18: H5.2 P1.14(RST) P5.31
RADIO_P12: P1.7(SCL) P2.5(SCL) P4.15 P6.4(SCL) P7.4(SCL) P8.4(SCL) R52.1 ; also on sheet 7
RADIO_P13: P1.5(SDA) P2.6(SDA) P4.16 P6.3(SDA) P7.3(SDA) P8.3(SDA) R53.1 ; also on sheet 7
RADIO_P15: P4.18 ; also on sheet 6
RADIO_P16: P4.19 ; also on sheet 6
RADIO_P17: P3.1(AN) P4.20
RADIO_P19: P2.3(RX) P4.22
RADIO_P20: P2.4(TX) P4.23 R63.1
RADIO_P24: P1.13(INT) P4.27
RADIO_P25: P1.10(SCK) P3.4(SCK) P4.28 ; also on sheet 6 7
RADIO_P26: P4.29 R22.1
RADIO_P27: P1.8(MISO) P3.5(MISO) P4.30 ; also on sheet 6 7
RADIO_P28: P4.31 R12.1
RADIO_P29: P1.6(MOSI) P3.6(MOSI) P4.32 ; also on sheet 6 7
RADIO_P30: P4.33 R30.1
RADIO_P31: P3.3(CS) P4.34
RADIO_P32: P4.35 ; also on sheet 6
RADIO_P33: P1.11(RX) P4.36
RADIO_P34: P1.12(CS) P4.37 ; also on sheet 7
RADIO_P35: P1.9(TX) P4.38
RADIO_P37: C5.2 D4.2(A) P5.4 R19.1 U2.4(COL)
RADIO_P40: P5.7 R34.1
RADIO_P41: P5.8 ; also on sheet 6
RADIO_P42: P5.9 ; also on sheet 6
RADIO_P43: P5.10 R26.1
RADIO_P44: CN18.2 P5.11
RADIO_P45: P2.2(INT) P5.12
$1N408: C1.2 Q2.1(G) R8.2 R12.2
$1N427: D2.1 LED29.1(K) Q2.3(D) RLY1.1
$1N683: LED29.2(A) R11.1
$1N1185: CN7.2 RLY1.5
$1N1209: CN7.3 RLY1.3
$1N2343: C18.2 Q3.1(G) R20.2 R22.2
$1N2345: D32.1 LED30.1(K) Q3.3(D) RLY2.1
$1N2346: LED30.2(A) R21.1
$1N2353: CN10.2 RLY2.5
$1N2354: CN10.3 RLY2.3
$1N2832: C20.2 Q4.1(G) R24.2 R26.2
$1N2834: D33.1 LED31.1(K) Q4.3(D) RLY3.1
$1N2835: LED31.2(A) R25.1
$1N2842: CN17.2 RLY3.5
$1N2843: CN17.3 RLY3.3
$1N2844: CN17.1 RLY3.2
$1N4265: C22.2 Q5.1(G) R28.2 R30.2
$1N4267: D34.1 LED34.1(K) Q5.3(D) RLY4.1
$1N4268: LED34.2(A) R29.1
$1N4275: CN12.2 RLY4.5
$1N4276: CN12.3 RLY4.3
$1N4277: CN12.1 RLY4.2
$1N4278: C24.2 Q6.1(G) R32.2 R34.2
$1N4280: D35.1 LED33.1(K) Q6.3(D) RLY5.1
$1N4281: LED33.2(A) R33.1
$1N4288: CN13.2 RLY5.5
$1N4289: CN13.3 RLY5.3
$1N4291: C26.2 Q7.1(G) R36.2 R38.2
$1N4293: D36.1 LED32.1(K) Q7.3(D) RLY6.1
$1N4294: LED32.2(A) R37.1
$1N4301: CN14.2 RLY6.5
$1N4302: CN14.3 RLY6.3
$1N28922: CN10.1 RLY2.2
$1N28939: CN7.1 RLY1.2
$1N28979: CN13.1 RLY5.2
$1N28996: CN14.1 RLY6.2
$2N6321: R5.1 SW1.2
$2N11421: R59.1 SW4.2
$3N1110: C4.1 D3.2(A) R16.2 R17.1 U2.2(CAT)
$3N1147: C6.2 R15.2 R16.1
$3N1152: CN21.1 LED37.2(-) R15.1
$3N2317: C28.1 D37.2(A) R41.2 R42.1 U11.2(CAT)
$3N2318: C30.2 R40.2 R41.1
$3N2319: CN21.2 LED36.2(-) R40.1
$3N2858: C31.1 D39.2(A) R46.2 R47.1 U12.2(CAT)
$3N2859: C33.2 R45.2 R46.1
$3N2860: CN21.3 LED38.2(-) R45.1
$3N21448: C32.2 D40.2(A) H5.1 R49.1 U12.4(COL)
$3N25161: LED36.1(+) R88.1
$3N25247: LED37.1(+) R89.1
$3N25335: LED38.1(+) R90.1

Not connected (* = marked no-connect by the designer): CN16 9* 10*; H5 3; P4 3* 4* 5* 6* 7* 8* 9* 10* 11* 12* 13* 14 17* 21* 24* 25* 26* 40*; P5 3* 5* 6* 18 28* 29* 30* 32* 33* 34* 35* 36*

## Notes on the sheets
sheet 1
- SMD
- TH
- GPIO_55
- UULP_VBAT_GPIO_0
- GPIO_47
- GPIO_52
- GPIO_48
- GPIO_49
sheet 2
- SiWx917-RB4338A Socket
- LED Strips connector(option)
- QWIIC CONNECTORS
- UPPER CONNECTOR
- Breakout Header
- SIWG917 PIN
- Function
- ULP_GPIO_6
- ULP_GPIO_7
- UULP_VBAT_GPIO_1
- INPUT
- GPIO_56
- Function
- SIWG917 PIN
- Breakout Header
- RELAY
- GPIO_52
- GPIO_53
- TFT_HXD8357 - DC
- TFT_HXD8357 - Y-
- GPIO_54
- GPIO_55
- RELAY
- MikroE MikroBus socket - RST
- GPIO_56
- GPIO_57
- RELAY
- JTAG_TDO_SWO
- JTAG_TMS_SWDIO
- JTAG_TCK_SWCLK
- JTAG_TDI
- RESET
- ULP_UART_TX/DEBUG
- ULP_GPIO_11
- ULP_GPIO_2
- RELAY
- MikroE MikroBus shuttle connector - PWM
- GPIO_8
- ULP_GPIO_9
- ULP_UART_RX/DEBUG
- ULP_GPIO_7
- MikroE MikroBus shuttle connector - ADC
- ULP_GPIO_2
- GPIO_10
- TFT_HXD8357 - X+
- ULP_GPIO_6
- INPUT
- RELAY
- UULP_VBAT_GPIO_0
- UULP_VBAT_GPIO_2
- GPIO_11
- LED Strips connector(option)
- INPUT
- UULP_VBAT_GPIO_3
- ULP_GPIO_7
- OK
- ULP_GPIO_6
- OK
- LOWER CONNECTOR
- Function
- SIWG917 PIN
- Breakout Header
- Breakout Header
- SIWG917 PIN
- Function
- SDA
- ULP_GPIO_6
- ULP_GPIO_7
- SCL
- TFT_HXD8357 - Y+
- ULP_GPIO_1
- ULP_GPIO_10
- ULP_GPIO_8
- ADC
- TFT_HXD8357 - X-
- GPIO_6
- UART_RX
- MikroE MikroBus socket - TX
- GPIO_7
- MikroE MikroBus socket
- MikroE MikroBus shuttle connector - INT
- GPIO_46
- GPIO_25
- MikroE MikroBus socket - CLK
- RELAY
- RELAY
- GPIO_47
- GPIO_48
- GPIO_26
- GPIO_27
- MikroE MikroBus socket - MISO
- MikroE MikroBus socket - MOSI
- ULP_GPIO_10
- GPIO_9
- RELAY
- GPIO_49
- GPIO_28
- MikroE MikroBus socket - CS0
- GPIO_8
- GPIO_57
- TFT_HXD8357 - CS1
- GPIO_50
- GPIO_29
- MikroE MikroBus shuttle connector - RX
- GPIO_28
- SIWG917 RX
- GPIO_6
- MikroE MikroBus shuttle connector - CS2
- GPIO_51
- GPIO_30
- MikroE MikroBus shuttle connector - TX
- GPIO_25
- GPIO_26
- SIWG917 TX
- GPIO_7
- ULP_GPIO_7
- GPIO_27
- ULP_GPIO_6
- We use BRD4338A => check the BRD4338A socket schematic
- MikroE MikroBus shuttle connector
- Mini Simplicity Connector
- ULP_GPIO_2
- GPIO11
- UULP_VBAT_GPIO_3
- GPIO_46
- ULP_GPIO_9
- RX
- RESET
- GPIO_25
- GPIO_51
- SIWG917 RX
- SIWG917 TX
- GPIO_29
- GPIO_30
- SWO
- TX
- ULP_GPIO_11
- GPIO_26
- ULP_GPIO_7
- SWCLK
- SWDIO
- GPIO_27
- ULP_GPIO_6
- ISP MODE BUTTON
- RESET BUTTON
- CHECK THE BRD8045A SCHEMATIC
sheet 3
- ISOLATED INPUTS
- UULP_VBAT_GPIO_1
- UULP_VBAT_GPIO_0
- MikroE MikroBus shuttle connector - RST
- UULP_VBAT_GPIO_8
